# EAGLE design Adapter 8x8 (EAGLE 5.05)
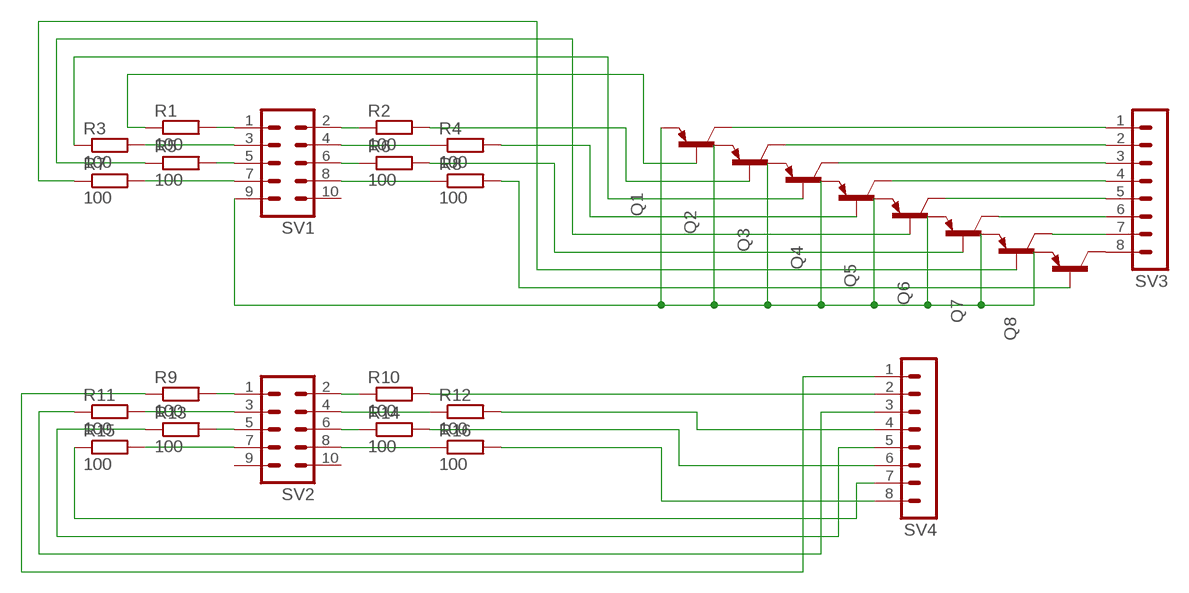
[diagram p0: schematic, sheet 1]

## Parts
Q1  BC807-16LT1SMD  [SOT23-BEC]
Q2  BC807-16LT1SMD  [SOT23-BEC]
Q3  BC807-16LT1SMD  [SOT23-BEC]
Q4  BC807-16LT1SMD  [SOT23-BEC]
Q5  BC807-16LT1SMD  [SOT23-BEC]
Q6  BC807-16LT1SMD  [SOT23-BEC]
Q7  BC807-16LT1SMD  [SOT23-BEC]
Q8  BC807-16LT1SMD  [SOT23-BEC]
R1  100  R-EU_R0805  [R0805]
R2  100  R-EU_R0805  [R0805]
R3  100  R-EU_R0805  [R0805]
R4  100  R-EU_R0805  [R0805]
R5  100  R-EU_R0805  [R0805]
R6  100  R-EU_R0805  [R0805]
R7  100  R-EU_R0805  [R0805]
R8  100  R-EU_R0805  [R0805]
R9  100  R-EU_R0805  [R0805]
R10  100  R-EU_R0805  [R0805]
R11  100  R-EU_R0805  [R0805]
R12  100  R-EU_R0805  [R0805]
R13  100  R-EU_R0805  [R0805]
R14  100  R-EU_R0805  [R0805]
R15  100  R-EU_R0805  [R0805]
R16  100  R-EU_R0805  [R0805]
SV1  MA05-2  [MA05-2]
SV2  MA05-2  [MA05-2]
SV3  MA08-1  [MA08-1]
SV4  MA08-1  [MA08-1]

## Nets
N$1: Q8.C SV3.8
N$2: Q7.C SV3.7
N$3: Q6.C SV3.6
N$4: Q5.C SV3.5
N$5: Q4.C SV3.4
N$6: Q3.C SV3.3
N$7: Q2.C SV3.2
N$8: Q1.C SV3.1
N$9: R1.2 SV1.1
N$10: R2.1 SV1.2
N$11: R3.2 SV1.3
N$12: R4.1 SV1.4
N$13: R5.2 SV1.5
N$14: R6.1 SV1.6
N$15: R7.2 SV1.7
N$16: R8.1 SV1.8
N$17: Q1.B R1.1
N$18: Q2.B R2.2
N$19: Q3.B R3.1
N$20: Q4.B R4.2
N$21: Q5.B R5.1
N$22: Q6.B R6.2
N$23: Q7.B R7.1
N$24: Q8.B R8.2
N$25: Q1.E Q2.E Q3.E Q4.E Q5.E Q6.E Q7.E Q8.E SV1.9
N$26: R9.2 SV2.1
N$27: R11.2 SV2.3
N$28: R13.2 SV2.5
N$29: R15.2 SV2.7
N$30: R10.1 SV2.2
N$31: R12.1 SV2.4
N$32: R14.1 SV2.6
N$33: R16.1 SV2.8
N$34: R12.2 SV4.4
N$35: R10.2 SV4.2
N$36: R9.1 SV4.1
N$37: R14.2 SV4.6
N$38: R16.2 SV4.8
N$39: R15.1 SV4.7
N$40: R13.1 SV4.5
N$41: R11.1 SV4.3
Unconnected: SV1.10 SV2.9 SV2.10

## Library data of the parts
Q1-Q8 = transistor-pnp:BC807*: PNP Transistror
R1-R16 = rcl:R-EU_: RESISTOR, European symbol
SV1 SV2 = con-lstb:MA05-2: PIN HEADER
SV3 SV4 = con-lstb:MA08-1: PIN HEADER

## Board
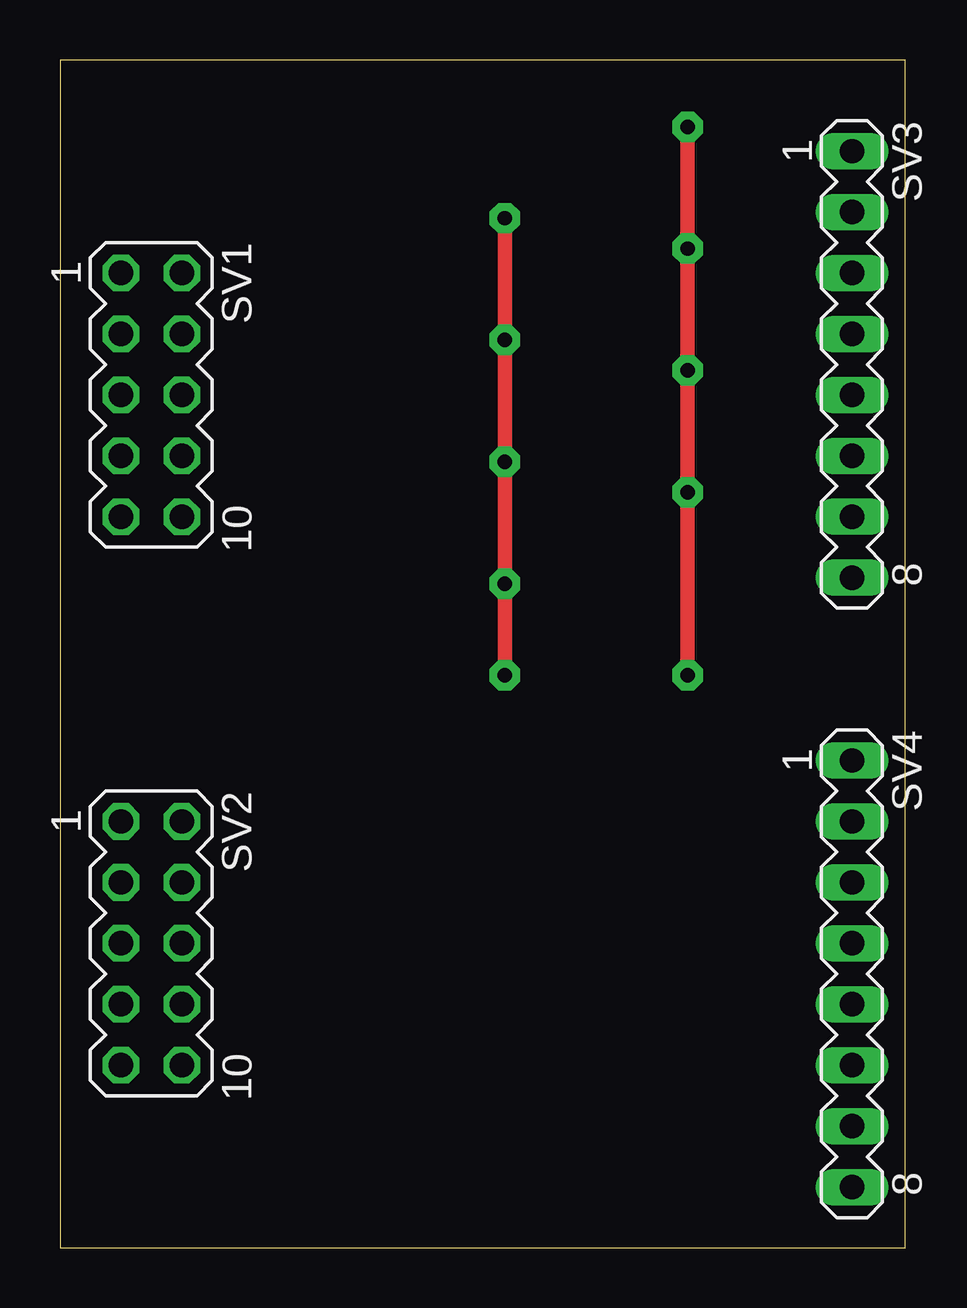
[diagram p1: board, top side]
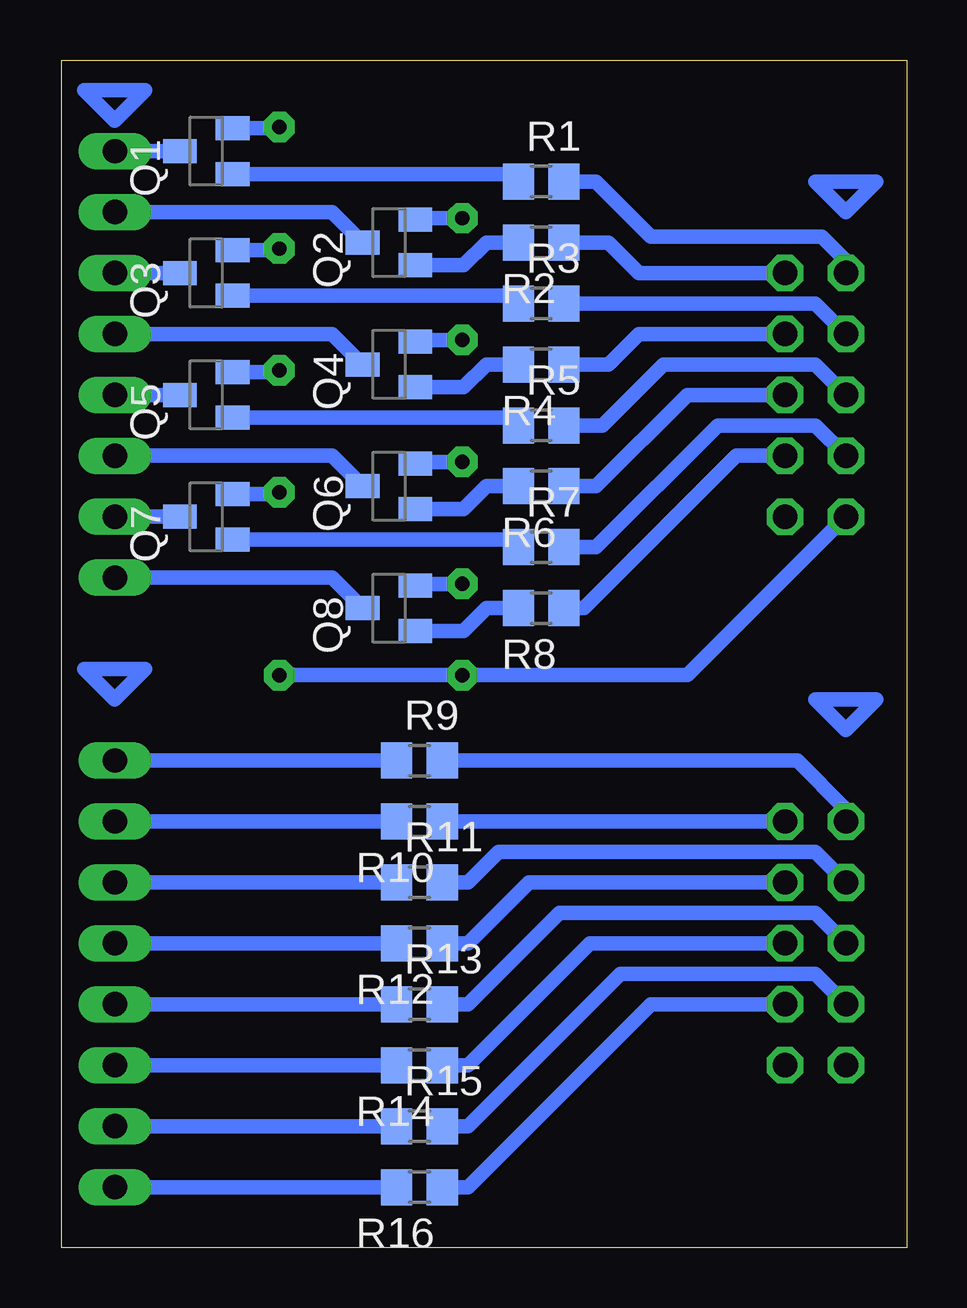
[diagram p2: board, bottom side, seen from below]

Size 35.23 x 49.52 mm. Coordinates in mm from the lower left corner, seen from the top.
Outline: 0,0 35.23,0 35.23,49.52 0,49.52 0,0
Copper layers (1*16): Top 0.035mm / dielectric 1.5mm / Bottom 0.035mm
Design rules "default": minimum track width 10mil, minimum drill 24mil, track to track 8mil, track to pad 8mil, pad to pad 8mil, via to via 8mil, smd to smd 8mil, copper to edge 40mil, drill to drill 8mil, minimum pad ring 10mil, minimum via ring 8mil, stop-mask expansion 4mil, vias tented up to drill 0mil, thermal gap 10mil

### Footprints (pad centres in the part's own frame; a part is rotated, then mirrored left to right if it is on the bottom)
SOT23-BEC = smd 1 x 1.4: B -0.95,-1.1; C 0,1.1; E 0.95,-1.1
R0805 = smd 1.3 x 1.5: 1 -0.95,0; 2 0.95,0
MA05-2 = drill 1.016 octagon: 1 -5.08,-1.27; 2 -5.08,1.27; 3 -2.54,-1.27; 4 -2.54,1.27; 5 0,-1.27; 6 0,1.27; 7 2.54,-1.27; 8 2.54,1.27; 9 5.08,-1.27; 10 5.08,1.27
MA08-1 = drill 1.016 long: 1 -8.89,0; 2 -6.35,0; 3 -3.81,0; 4 -1.27,0; 5 1.27,0; 6 3.81,0; 7 6.35,0; 8 8.89,0

### Placement (x,y rotation side)
Q1  29.21,45.72 90 bottom
Q2  21.59,41.91 90 bottom
Q3  29.21,40.64 90 bottom
Q4  21.59,36.83 90 bottom
Q5  29.21,35.56 90 bottom
Q6  21.59,31.75 90 bottom
Q7  29.21,30.48 90 bottom
Q8  21.59,26.67 90 bottom
R1  15.24,44.45 0 bottom
R2  15.24,41.91 180 bottom
R3  15.24,39.37 0 bottom
R4  15.24,36.83 180 bottom
R5  15.24,34.29 0 bottom
R6  15.24,31.75 180 bottom
R7  15.24,29.21 0 bottom
R8  15.24,26.67 180 bottom
R9  20.32,20.32 0 bottom
R10  20.32,17.78 180 bottom
R11  20.32,15.24 0 bottom
R12  20.32,12.7 180 bottom
R13  20.32,10.16 0 bottom
R14  20.32,7.62 180 bottom
R15  20.32,5.08 0 bottom
R16  20.32,2.54 180 bottom
SV1  3.81,35.56 270 top
SV2  3.81,12.7 270 top
SV3  33.02,36.83 270 top
SV4  33.02,11.43 270 top

### Tracks (layer width: path | path; a pad name or v marks a point on that pad's centre or on a via)
N$1
  Bottom 0.61: SV3.8 23.96,27.94 Q8.C
N$2
  Bottom 0.61: Q7.C SV3.7
N$3
  Bottom 0.61: SV3.6 23.96,33.02 Q6.C
N$4
  Bottom 0.61: Q5.C SV3.5
N$5
  Bottom 0.61: SV3.4 23.96,38.1 Q4.C
N$6
  Bottom 0.61: Q3.C SV3.3
N$7
  Bottom 0.61: SV3.2 23.96,43.18 Q2.C
N$8
  Bottom 0.61: Q1.C SV3.1
N$9
  Bottom 0.61: SV1.1 2.54,41.15 3.56,42.16 10.67,42.16 12.95,44.45 R1.2
N$10
  Bottom 0.61: SV1.2 11.18,40.64 12.45,41.91 R2.1
N$11
  Bottom 0.61: SV1.3 3.81,39.37 R3.2
N$12
  Bottom 0.61: SV1.4 11.18,38.1 12.45,36.83 R4.1
N$13
  Bottom 0.61: SV1.5 3.81,36.83 10.16,36.83 12.7,34.29 R5.2
N$14
  Bottom 0.61: SV1.6 9.14,35.56 12.95,31.75 R6.1
N$15
  Bottom 0.61: SV1.7 3.81,34.29 7.87,34.29 12.95,29.21 R7.2
N$16
  Bottom 0.61: SV1.8 7.11,33.02 13.46,26.67 R8.1
N$17
  Bottom 0.61: Q1.B 16.51,44.77 R1.1
N$18
  Bottom 0.61: Q2.B 18.48,40.96 17.53,41.91 R2.2
N$19
  Bottom 0.61: Q3.B 16.51,39.69 R3.1
N$20
  Bottom 0.61: Q4.B 18.48,35.88 17.53,36.83 R4.2
N$21
  Bottom 0.61: Q5.B 16.51,34.61 R5.1
N$22
  Bottom 0.61: Q6.B 18.48,30.8 17.53,31.75 R6.2
N$23
  Bottom 0.61: Q7.B 16.51,29.53 R7.1
N$24
  Bottom 0.61: Q8.B 18.48,25.72 17.53,26.67 R8.2
N$25  (via drill 0.6 pad 1.27)
  Top 0.61: v26.16,23.88 v26.16,31.5 v26.16,36.58 v26.16,41.66 v26.16,46.74 | v18.54,23.88 v18.54,27.69 v18.54,32.77 v18.54,37.85 v18.54,42.93
  Bottom 0.61: SV1.9 9.14,23.88 v18.54,23.88 v26.16,23.88 | v26.16,31.5 26.23,31.43 Q7.E | v26.16,36.58 26.23,36.51 Q5.E | v26.16,41.66 26.23,41.59 Q3.E | v26.16,46.74 26.23,46.67 Q1.E | Q8.E 20.42,27.69 v18.54,27.69 | Q6.E 20.42,32.77 v18.54,32.77 | Q4.E 20.42,37.85 v18.54,37.85 | Q2.E 20.42,42.93 v18.54,42.93
N$26
  Bottom 0.61: R9.2 4.57,20.32 2.54,18.29 SV2.1
N$27
  Bottom 0.61: R11.2 18.29,15.24 17.02,16.51 3.81,16.51 SV2.3
N$28
  Bottom 0.61: R13.2 18.29,10.16 14.48,13.97 3.81,13.97 SV2.5
N$29
  Bottom 0.61: R15.2 18.29,5.08 11.94,11.43 3.81,11.43 SV2.7
N$30
  Bottom 0.61: R10.1 SV2.2
N$31
  Bottom 0.61: R12.1 18.29,12.7 15.75,15.24 SV2.4
N$32
  Bottom 0.61: R14.1 18.29,7.62 13.21,12.7 SV2.6
N$33
  Bottom 0.61: R16.1 18.29,2.54 10.67,10.16 SV2.8
N$34
  Bottom 0.61: R12.2 SV4.4
N$35
  Bottom 0.61: R10.2 SV4.2
N$36
  Bottom 0.61: SV4.1 R9.1
N$37
  Bottom 0.61: R14.2 SV4.6
N$38
  Bottom 0.61: R16.2 SV4.8
N$39
  Bottom 0.61: R15.1 SV4.7
N$40
  Bottom 0.61: R13.1 SV4.5
N$41
  Bottom 0.61: R11.1 SV4.3
N$42
  Bottom 0.61: 1.27,44.45 2.54,43.18 3.81,44.45 1.27,44.45
N$43
  Bottom 0.61: 2.54,21.59 3.81,22.86 1.27,22.86 2.54,21.59
N$44
  Bottom 0.61: 34.29,24.13 33.02,22.86 31.75,24.13 34.29,24.13 | 33.02,46.99 31.75,48.26 34.29,48.26 33.02,46.99